# EAGLE design PocketStateMachine_r0_3 (EAGLE 7.7.0)
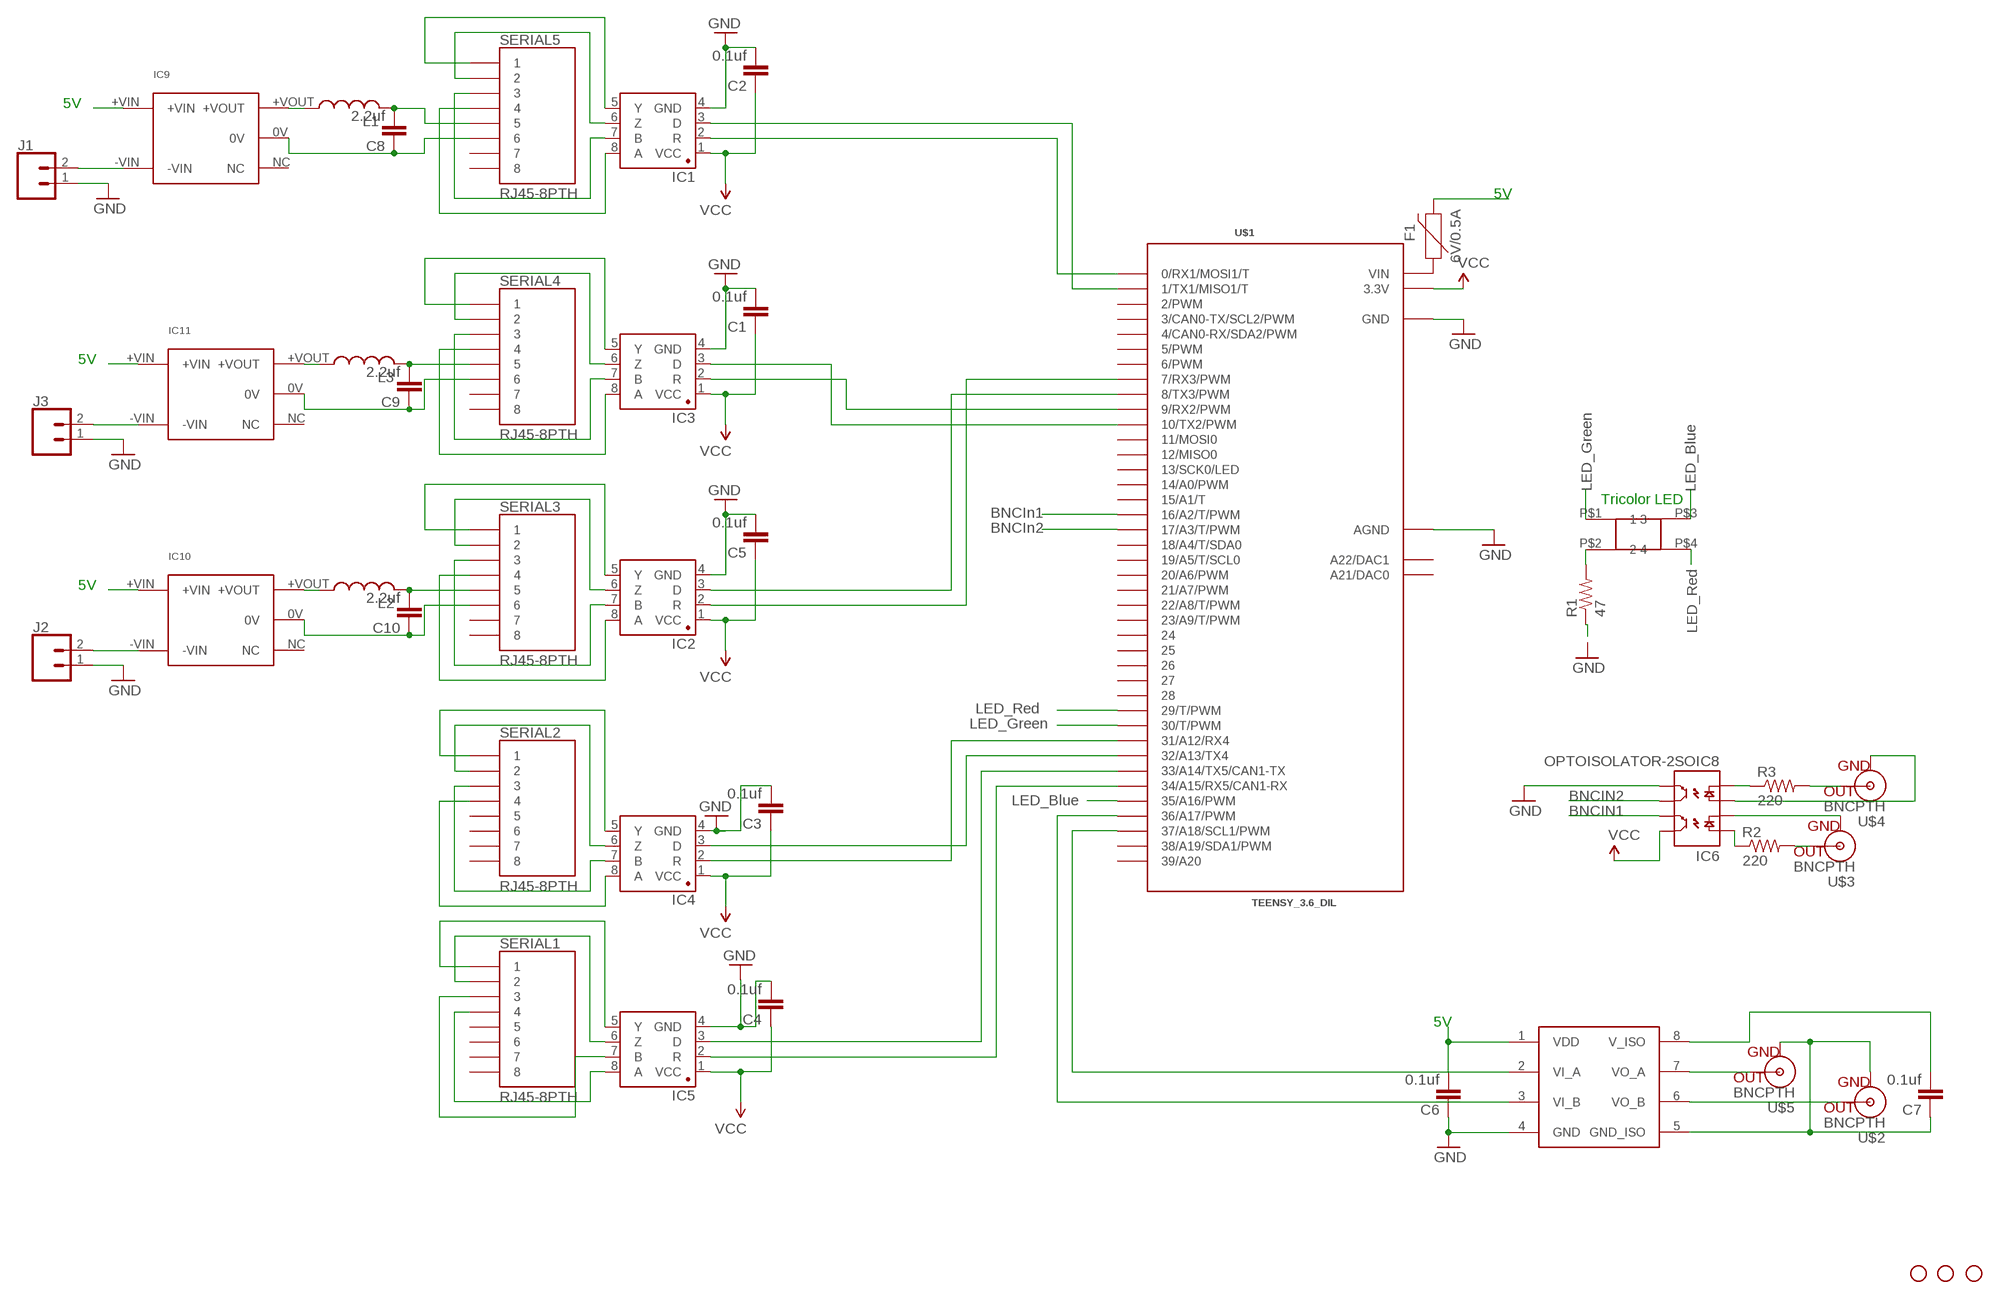
[diagram p0: schematic, sheet 1]

## Parts
C1  0.1uf  CAP1206  [1206]
C2  0.1uf  CAP1206  [1206]
C3  0.1uf  CAP1206  [1206]
C4  0.1uf  CAP1206  [1206]
C5  0.1uf  CAP1206  [1206]
C6  0.1uf  CAP1206  [1206]
C7  0.1uf  CAP1206  [1206]
C8  2.2uf  CAP1206  [1206]
C9  2.2uf  CAP1206  [1206]
C10  2.2uf  CAP1206  [1206]
F1  6V/0.5A  PPTC_HALF-AMP  [1206]
IC1  SN65HVD31DR  [SO08]
IC2  SN65HVD31DR  [SO08]
IC3  SN65HVD31DR  [SO08]
IC4  SN65HVD31DR  [SO08]
IC5  SN65HVD31DR  [SO08]
IC6  OPTOISOLATOR-2SOIC8  [SO08-2]
IC7  ADUM5240  [SO08]
IC9  MTU1D0505MC  [MTU1D0505MC]
IC10  MTU1D0505MC  [MTU1D0505MC]
IC11  MTU1D0505MC  [MTU1D0505MC]
J1  CONN_02  [1X02]
J2  CONN_02  [1X02]
J3  CONN_02  [1X02]
JP3  STAND-OFF  [STAND-OFF]
JP4  STAND-OFF  [STAND-OFF]
JP5  STAND-OFF  [STAND-OFF]
L1  L-USL3225M  [L3225M]
L2  L-USL3225M  [L3225M]
L3  L-USL3225M  [L3225M]
R1  47  RESISTOR1206  [1206]
R2  220  RESISTOR1206  [1206]
R3  220  RESISTOR1206  [1206]
SERIAL1  RJ45-8PTH  [RJ45-8]
SERIAL2  RJ45-8PTH  [RJ45-8]
SERIAL3  RJ45-8PTH  [RJ45-8]
SERIAL4  RJ45-8PTH  [RJ45-8]
SERIAL5  RJ45-8PTH  [RJ45-8]
U$1  TEENSY_3.6_DIL  [TEENSY_3.6_DIL]
U$2  BNCPTH  [BNC]
U$3  BNCPTH  [BNC]
U$4  BNCPTH  [BNC]
U$5  BNCPTH  [BNC]
U$8  SQUARE_TRICOLOR_LED  [SQUARE_TRICOLOR_LED]

## Nets
5V: C6.2 F1.2 IC7.1(VDD) IC9.+VIN IC10.+VIN IC11.+VIN
BNCIN1: IC6.7(EM1) U$1.16/A2(16/A2/T/PWM)
BNCIN2: IC6.6(CL2) U$1.17/A3(17/A3/T/PWM)
GND: C1.2 C2.2 C3.2 C4.2 C5.2 C6.1 IC1.4(GND) IC2.4(GND) IC3.4(GND) IC4.4(GND) IC5.4(GND) IC6.5(EM2) IC7.4(GND) J1.1 J2.1 J3.1 R1.1 U$1.AGND U$1.GND U$1.GND1(GND)
ISOGND: C7.1 IC7.5(GND_ISO) U$2.GND U$5.GND
LED_BLUE: U$1.35/A16(35/A16/PWM) U$8.P$3
LED_GREEN: U$1.30(30/T/PWM) U$8.P$1
LED_RED: U$1.29(29/T/PWM) U$8.P$4
N$1: IC3.8(A) SERIAL4.4
N$2: IC3.7(B) SERIAL4.3
N$3: IC3.6(Z) SERIAL4.2
N$4: IC3.5(Y) SERIAL4.1
N$5: IC3.2(R) U$1.9(9/RX2/PWM)
N$6: IC3.3(D) U$1.10(10/TX2/PWM)
N$7: IC1.8(A) SERIAL5.4
N$8: IC1.7(B) SERIAL5.3
N$9: IC1.6(Z) SERIAL5.2
N$10: IC1.5(Y) SERIAL5.1
N$11: IC1.2(R) U$1.0(0/RX1/MOSI1/T)
N$12: IC1.3(D) U$1.1(1/TX1/MISO1/T)
N$13: IC6.3(A2) U$4.GND
N$14: R3.2 U$4.S(OUT)
N$15: R2.2 U$3.S(OUT)
N$16: IC6.2(C1) U$3.GND
N$17: IC2.8(A) SERIAL3.4
N$18: IC2.7(B) SERIAL3.3
N$19: IC2.6(Z) SERIAL3.2
N$20: IC7.3(VI_B) U$1.36/A17(36/A17/PWM)
N$21: IC2.5(Y) SERIAL3.1
N$22: IC2.2(R) U$1.7(7/RX3/PWM)
N$23: C8.2 L1.2 SERIAL5.5
N$24: IC7.2(VI_A) U$1.37/A18(37/A18/SCL1/PWM)
N$25: R1.2 U$8.P$2
N$26: C8.1 IC9.0V SERIAL5.6
N$27: IC7.7(VO_A) U$5.S(OUT)
N$28: IC2.3(D) U$1.8(8/TX3/PWM)
N$29: F1.1 U$1.VIN
N$30: IC7.6(VO_B) U$2.S(OUT)
N$32: IC5.8(A) SERIAL1.4
N$33: IC5.7(B) SERIAL1.3
N$34: IC5.6(Z) SERIAL1.2
N$35: IC5.5(Y) SERIAL1.1
N$36: IC4.8(A) SERIAL2.4
N$37: IC4.7(B) SERIAL2.3
N$38: IC4.6(Z) SERIAL2.2
N$39: IC9.+VOUT L1.1
N$40: IC4.5(Y) SERIAL2.1
N$41: IC9.-VIN J1.2
N$42: IC5.2(R) U$1.34/A15(34/A15/RX5/CAN1-RX)
N$43: C10.1 IC10.0V SERIAL3.6
N$44: C10.2 L2.2 SERIAL3.5
N$45: IC10.+VOUT L2.1
N$46: IC10.-VIN J2.2
N$47: C9.1 IC11.0V SERIAL4.6
N$48: IC5.3(D) U$1.33/A14(33/A14/TX5/CAN1-TX)
N$49: C9.2 L3.2 SERIAL4.5
N$50: IC11.+VOUT L3.1
N$51: IC11.-VIN J3.2
N$52: IC4.2(R) U$1.31/A12(31/A12/RX4)
N$53: IC4.3(D) U$1.32/A13(32/A13/TX4)
N$54: IC6.1(A1) R2.1
N$55: IC6.4(C2) R3.1
N$64: C7.2 IC7.8(V_ISO)
VCC: C1.1 C2.1 C3.1 C4.1 C5.1 IC1.1(VCC) IC2.1(VCC) IC3.1(VCC) IC4.1(VCC) IC5.1(VCC) IC6.8(CL1) U$1.3.3V U$1.3.3V3(3.3V)
Unconnected: IC9.NC IC10.NC IC11.NC SERIAL1.5 SERIAL1.6 SERIAL1.7 SERIAL1.8 SERIAL2.5 SERIAL2.6 SERIAL2.7 SERIAL2.8 SERIAL3.7 SERIAL3.8 SERIAL4.7 SERIAL4.8 SERIAL5.7 SERIAL5.8 U$1.2(2/PWM) U$1.3(3/CAN0-TX/SCL2/PWM) U$1.4(4/CAN0-RX/SDA2/PWM) U$1.5(5/PWM) U$1.6(6/PWM) U$1.11(11/MOSI0) U$1.12(12/MISO0) U$1.13(13/SCK0/LED) U$1.14/A0(14/A0/PWM) U$1.15/A1(15/A1/T) U$1.18/A4(18/A4/T/SDA0) U$1.19/A5(19/A5/T/SCL0) U$1.20/A6(20/A6/PWM) U$1.21/A7(21/A7/PWM) U$1.22/A8(22/A8/T/PWM) U$1.23/A9(23/A9/T/PWM) U$1.24 U$1.25 U$1.26 U$1.27 U$1.28 U$1.38/A19(38/A19/SDA1/PWM) U$1.39/A20 U$1.A21(A21/DAC0) U$1.A22(A22/DAC1)

## Notes on the sheet
- 5V
- 5V
- 5V
- LED_Green
- LED_Blue
- Tricolor LED
- BNCIn1
- BNCIn2
- LED_Red
- 5V
- LED_Red
- LED_Green
- BNCIN2
- LED_Blue
- BNCIN1
- 5V

## Library data of the parts
C1-C10 = SparkFun-Capacitors:CAP: Capacitor Standard 0603 ceramic capacitor, and 0.1" leaded capacitor.
F1 = SparkFun-Fuses:PPTC: Resettable Fuse PPTC Resettable Fuse. Really a sort of resistor with a polymeric positive temperature coefficient whose resistance increases dramatically with an increase in temperature. When heated by the power passing through the resistance rises causing the current to be limited, protecting the circuit. This is achieved by the transition of the polymer from a crystalline to an amorphous state where the conductive carbon separates breaking the conductive pathways found in the cool crystalline structure. When a PPTC cools back down it resumes conducting letting the circuit turn back on. SparkFun Products: SparkFun RedBoard - Programmed with Arduino <https://www.sparkfun.com/products/12757> Pro Micro - 5V/16MHz <https://www.sparkfun.com/products/12640> Arduino Pro 328 - 5V/16MHz <https://www.sparkfun.com/products/10915> MP3 Trigger <https://www.sparkfun.com/products/13720>; PROD_ID: RES-08585
IC1-IC5 = Joshparts4:SN65HVD31DR: A placeholder for generic narrow & wide SOIC8 foorptints - used on the DIP adapter board.
IC6 = SparkFun-DiscreteSemi:OPTOISOLATOR-2: Description: Dual gate opto isolator. Vishay part : ILD213T; PROD_ID: IC-09076
IC7 = SparkFun-DigitalIC:ADUM5240
IC9-IC11 = JoshParts10:MTU1D0505MC
J1-J3 = SparkFun-Connectors:CONN_02: Multi connection point. Often used as Generic Header-pin footprint for 0.1 inch spaced/style header connections On any of the 0.1 inch spaced packages, you can populate with these: Break Away Headers - Straight <https://www.sparkfun.com/products/116> (PRT-00116) Break Away Male Headers - Right Angle <https://www.sparkfun.com/products/553> (PRT-00553) Female Headers <https://www.sparkfun.com/products/115> (PRT-00115) Break Away Headers - Machine Pin <https://www.sparkfun.com/products/117> (PRT-00117) Break Away Female Headers - Swiss Machine Pin <https://www.sparkfun.com/products/743> (PRT-00743) For SCREWTERMINALS and SPRING TERMINALS visit here: Screw Terimnals on SparkFun.com <https://www.sparkfun.com/search/results?term=Screw+Terminals> (5mm/3.5mm/2.54mm spacing) This device is also useful as a general connection point to wire up your design to another part of your project. Our various solder wires solder well into these plated through hole pads. Hook-Up Wire - Assortment (Stranded, 22 AWG) <https://www.sparkfun.com/products/11375> (PRT-11375) Hook-Up Wire - Assortment (Solid Core, 22 AWG) <https://www.sparkfun.com/products/11367> (PRT-11367) View the entire wire category on our website here <https://www.sparkfun.com/categories/141> Special notes: Molex polarized connector foot print use with: PRT-08233 with associated crimp pins and housings. 2.54_SCREWTERM for use with PRT-10571. 3.5mm Screw Terminal footprints for PRT-08084 5mm Screw Terminal footprints for use with PRT-08432
JP3-JP5 = SparkFun:STAND-OFF: Stand Off This is the mechanical footprint for a #4 phillips button head screw. Use the keepout ring to avoid running the screw head into surrounding components. SKU : PRT-00447
L1-L3 = rcl:L-US: INDUCTOR, American symbol
R1 = SparkFun-Passives:RESISTOR: Resistor Basic schematic elements and footprints for 0603, 1206, and PTH resistors.
R2 R3 = SparkFun-Resistors:RESISTOR: Resistor Basic schematic elements and footprints for 0603, 1206, and PTH resistors.
SERIAL1-SERIAL5 = SparkFun:RJ45-8: RJ45 Jack Simple RJ45, 8-pin connection - connector for common Cat5, Cat5e, and Cat6 Ethernet cables. Footprint not yet proven in production. Connector sku is PRT-00643; Breakout PCB sku is BOB-00716.
U$1 = Teensy_3_and_LC_Series_Boards_v1.4:TEENSY_3.6_DIL: Teensy 3.6 DIL Package
U$2-U$5 = SparkFun:BNC: BNC Connector, Mouser Part# 5227161
U$8 = JoshParts:SQUARE_TRICOLOR_LED

## Net classes
0 default: width 0.254 mm, clearance 0.254 mm

## Board
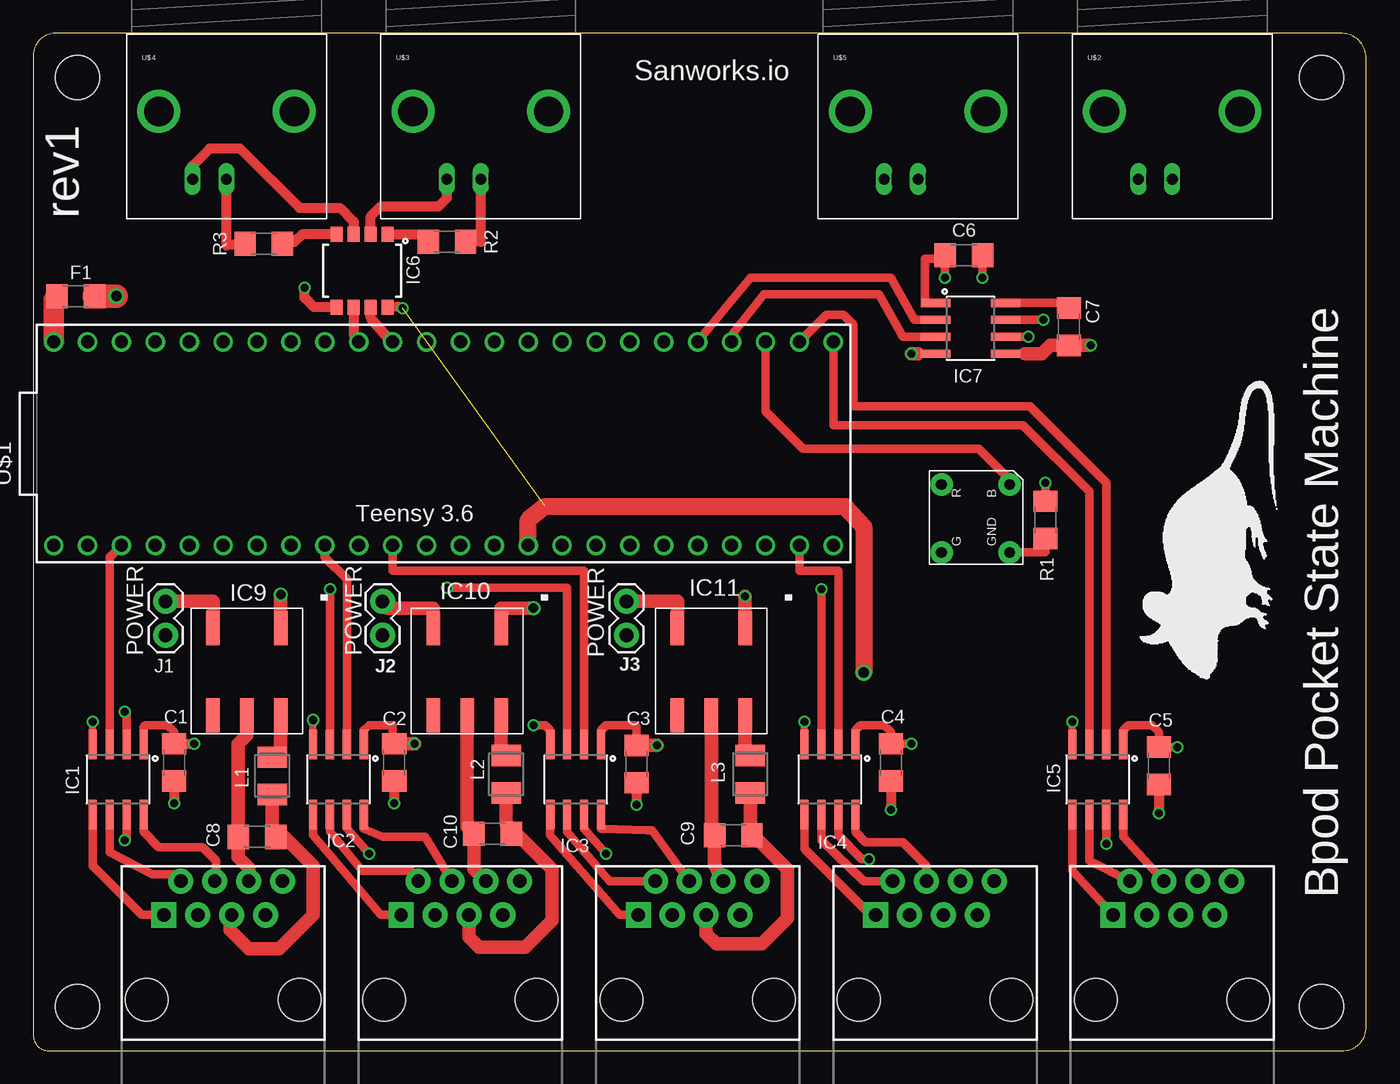
[diagram p1: board, top side]
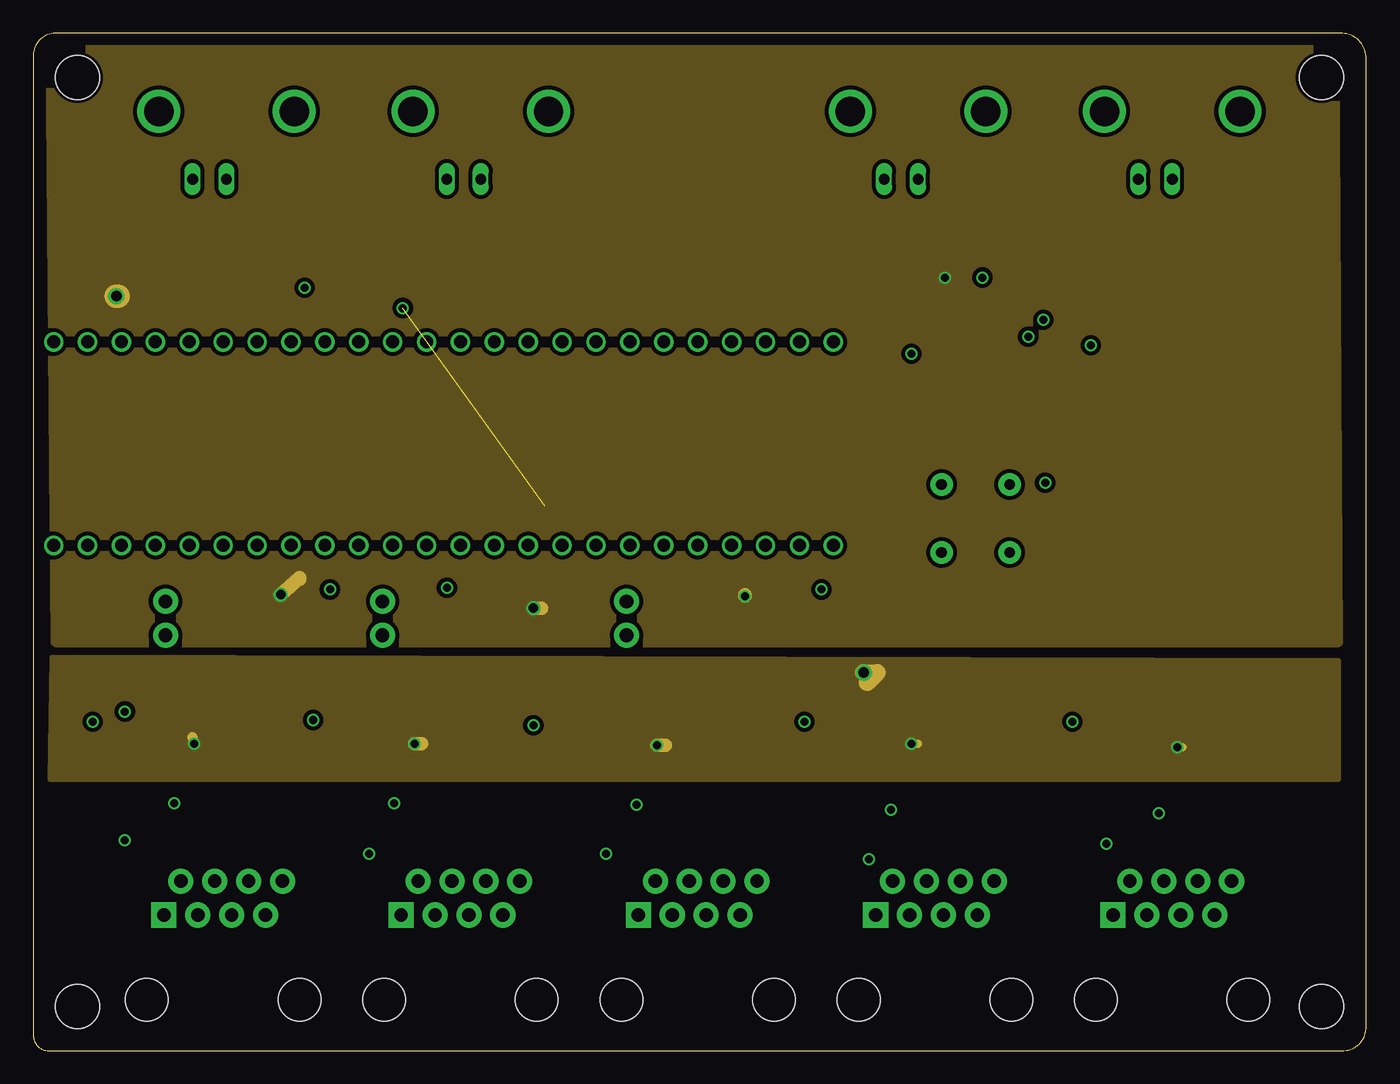
[diagram p2: board, inner layer Route2]
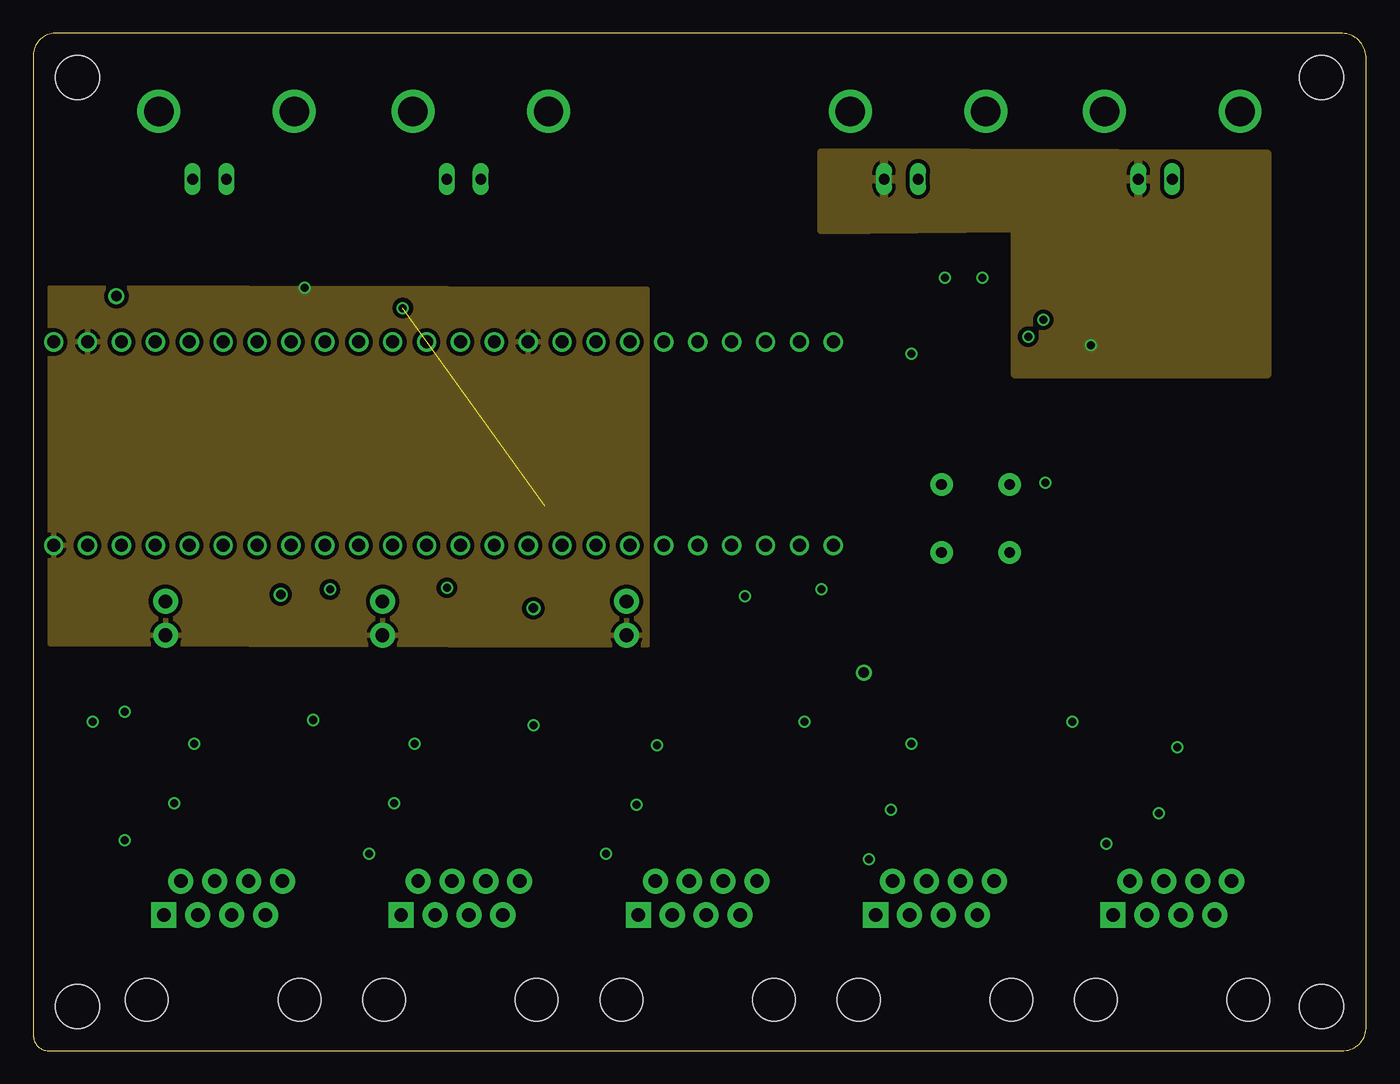
[diagram p3: board, inner layer Route15]
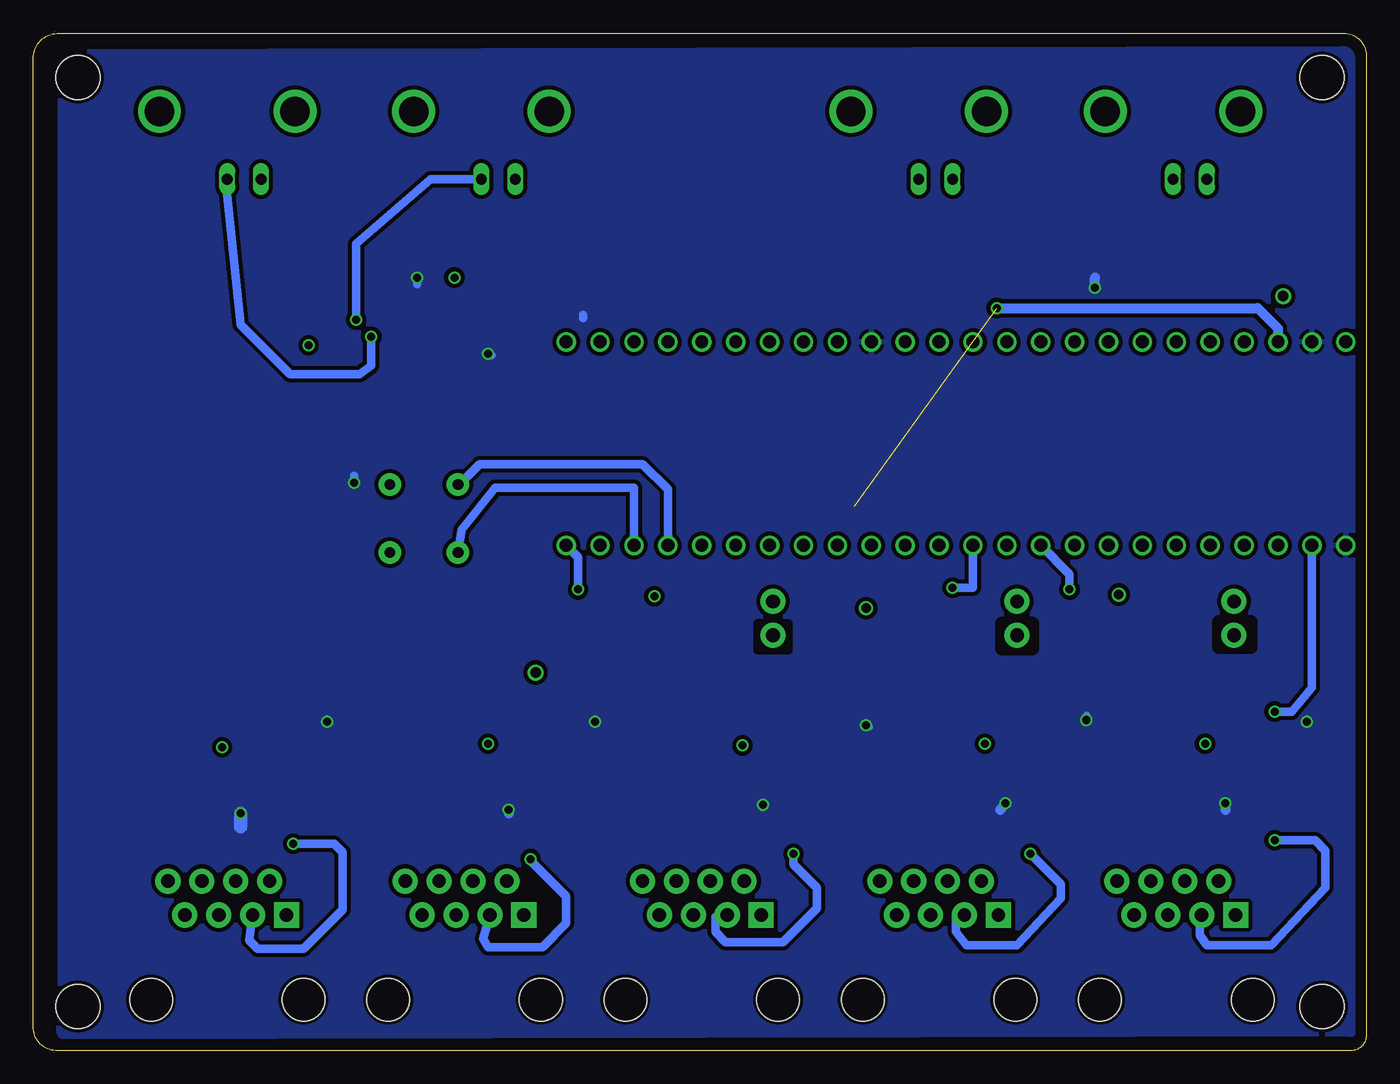
[diagram p4: board, bottom side, seen from below]

Size 99.87 x 76.2 mm. Coordinates in mm from the lower left corner, seen from the top.
Outline: 0,74.57 0,1.14 arc90 1.14,0 98.21,0 arc90 99.87,1.79 99.87,74.29 arc90 98.09,76.2 1.63,76.2 arc90 0,74.57
Copper layers (1*2*15*16): Top 0.035mm / dielectric 0.2mm / Route2 0.0175mm / dielectric 0.3mm / Route15 0.0175mm / dielectric 0.2mm / Bottom 0.035mm
Design rules "SeeedStudio_4layer_DRU_no_angle_20140221 *": minimum track width 8mil, minimum drill 12mil, track to track 12mil, track to pad 12mil, pad to pad 12mil, via to via 12mil, smd to smd 0mil, copper to edge 10mil, drill to drill 8mil, minimum pad ring 6mil, minimum via ring 4mil, stop-mask expansion 4mil, vias tented up to drill 25mil, thermal gap 10mil
bRestrict: area 8.6,30.2 to 11,32.1; area 25,30.1 to 27.3,32; area 43.3,30 to 45.6,32

### Footprints (pad centres in the part's own frame; a part is rotated, then mirrored left to right if it is on the bottom)
1206 = smd 1.6 x 1.8: 1 -1.4,0; 2 1.4,0
SO08 = smd 0.61 x 2.21: 1 -1.905,-2.616; 2 -0.635,-2.616; 3 0.635,-2.616; 4 1.905,-2.616; 5 1.905,2.616; 6 0.635,2.616; 7 -0.635,2.616; 8 -1.905,2.616
SO08-2 = smd 0.914 x 1.143: 1 -1.905,-2.731; 2 -0.635,-2.731; 3 0.635,-2.731; 4 1.905,-2.731; 5 1.905,2.731; 6 0.635,2.731; 7 -0.635,2.731; 8 -1.905,2.731
MTU1D0505MC = smd 2.54 x 1.016: 0V 6.502,0; +VIN 0,2.54; +VOUT 6.502,2.54; -VIN 0,-2.54; NC 6.502,-2.54
1X02 = drill 1.016 pad 1.88: 1 0,0; 2 2.54,0
STAND-OFF = hole 3.302: 0,0
L3225M = smd 1.6 x 2.2: 1 -1.4,0; 2 1.4,0
RJ45-8 = drill 1 pad 1.88 square: 1 -4.445,6.35 | drill 1 pad 1.88: 2 -3.175,8.89; 3 -1.905,6.35; 4 -0.635,8.89; 5 0.635,6.35; 6 1.905,8.89; 7 3.175,6.35; 8 4.445,8.89 | hole 3.2: -5.715,0; 5.715,0
TEENSY_3.6_DIL = drill 0.965: 0 -7.62,25.4; 1 -7.62,22.86; 2 -7.62,20.32; 3 -7.62,17.78; 3.3V 7.62,22.86; 3.3V3 -7.62,-7.62; 4 -7.62,15.24; 5 -7.62,12.7; 6 -7.62,10.16; 7 -7.62,7.62; 8 -7.62,5.08; 9 -7.62,2.54; 10 -7.62,0; 11 -7.62,-2.54; 12 -7.62,-5.08; 13 7.62,-5.08; 14/A0 7.62,-2.54; 15/A1 7.62,0; 16/A2 7.62,2.54; 17/A3 7.62,5.08; 18/A4 7.62,7.62; 19/A5 7.62,10.16; 20/A6 7.62,12.7; 21/A7 7.62,15.24; 22/A8 7.62,17.78; 23/A9 7.62,20.32; 24 -7.62,-10.16; 25 -7.62,-12.7; 26 -7.62,-15.24; 27 -7.62,-17.78; 28 -7.62,-20.32; 29 -7.62,-22.86; 30 -7.62,-25.4; 31/A12 -7.62,-27.94; 32/A13 -7.62,-30.48; 33/A14 7.62,-30.48; 34/A15 7.62,-27.94; 35/A16 7.62,-25.4; 36/A17 7.62,-22.86; 37/A18 7.62,-20.32; 38/A19 7.62,-17.78; 39/A20 7.62,-15.24; A21 7.62,-12.7; A22 7.62,-10.16; AGND 7.62,25.4; GND -7.62,27.94; GND1 7.62,-7.62; VIN 7.62,27.94
BNC = drill 2.2: 3 -5.08,5.08; 4 5.08,5.08 | drill 0.8 long: GND -2.54,0; S 0,0
SQUARE_TRICOLOR_LED = drill 0.8 pad 1.676: P$1 -5.1,5.1; P$2 -5.1,0; P$3 0,0; P$4 0,5.1

### Placement (x,y rotation side)
C1  10.54,21.59 270 top
C2  27.05,21.59 270 top
C3  45.21,21.46 270 top
C4  64.26,21.59 270 top
C5  84.33,21.34 270 top
C6  69.72,59.56 180 top
C7  77.6,54.23 90 top
C8  16.76,16 0 top
C9  52.45,16.13 0 top
C10  34.42,16.26 0 top
F1  3.17,56.52 0 top
IC1  6.35,20.32 180 top
IC2  22.86,20.32 180 top
IC3  40.64,20.32 180 top
IC4  59.69,20.32 180 top
IC5  79.76,20.32 180 top
IC6  24.64,58.42 180 top
IC7  70.23,54.1 270 top
IC9  16,31.62 270 top
IC10  32.51,31.62 270 top
IC11  50.8,31.62 270 top
J1  9.91,31.11 90 top
J2  26.16,31.11 90 top
J3  44.45,31.11 90 top
JP1  STAND-OFF  [STAND-OFF]  3.3,3.3 0 top
JP3  3.3,72.9 0 top
JP4  96.52,72.9 0 top
JP5  96.52,3.3 0 top
L1  17.91,20.57 270 top
L2  35.43,20.7 270 top
L3  53.72,20.7 270 top
R1  75.82,39.75 270 top
R2  30.99,60.58 0 top
R3  17.27,60.45 180 top
SERIAL1  85.34,3.81 0 top
SERIAL2  67.56,3.81 0 top
SERIAL3  32,3.81 0 top
SERIAL4  49.78,3.81 0 top
SERIAL5  14.22,3.81 0 top
U$1  29.46,45.47 90 top
U$2  85.34,65.28 0 top
U$3  33.53,65.28 0 top
U$4  14.48,65.28 0 top
U$5  66.29,65.28 0 top
U$8  73.15,42.42 90 top
U$9  [MOUSELOGO]  81.06,25.88 0 top

### Tracks (layer width: path | path; a pad name or v marks a point on that pad's centre or on a via)
5V  (via drill 0.6, 0.7, 0.8)
  Top 0.635: IC7.1 66.8,56.01 66.8,59.31 67.06,59.31 68.32,59.31 C6.2 v68.32,57.91 v68.33,57.91
  Top 1.016: IC9.+VIN v18.54,34.16 | IC10.+VIN 35.05,33.15 v37.47,33.15 | IC11.+VIN v53.34,34.04
  Top 1.778: F1.2 v6.22,56.52
  Route2 1.016: v18.54,34.16 19.94,35.43 19.94,35.31 | v37.47,33.15 38.1,33.15 | v53.34,34.04 53.34,34.16
  Route2 1.778: v6.22,56.52 6.35,56.52
  Route15 0.635: v68.33,57.91 68.33,57.78
  pour Route2: 1.27,74.93 1.65,30.61 97.79,30.61 97.54,74.93
BNCIN1
  Top 0.762: U$1.16/A2 26.8,53.09 25.27,54.86 IC6.7
BNCIN2
  Top 0.762: IC6.6 24,53.59 U$1.17/A3
GND  (via drill 0.6)
  Top 0.508: IC2.4 v20.95,24.77 | IC1.4 v4.45,24.64 | IC4.4 v57.78,24.64 | IC5.4 v77.85,24.64
  Top 0.635: IC3.4 38.73,24 38.35,24.38 v37.47,24.38 | R1.1 v75.82,42.55 | C6.1 71.12,57.79 v71.12,57.91 | 66.29,52.2 IC7.4
  Top 0.762: C5.2 v84.33,17.78 | C4.2 v64.26,18.03 | C3.2 v45.21,18.41 | C2.2 v27.05,18.54 | C1.2 v10.54,18.54 | IC6.5 21.02,55.69 20.32,56.39 v20.32,57.15
  Top 1.016: v65.79,52.2 66.29,52.2
  Bottom 0.508: v20.95,24.77 20.95,25.15 | v4.45,24.64 4.45,24.89 | v37.47,24.38 37.21,24.26 | v57.78,24.64 57.78,24.89 | v77.85,24.64 77.85,24.89
  Bottom 0.635: 58.67,55.12 58.67,54.86 | v75.82,42.55 75.82,43.05 | v71.12,57.91 71.12,57.4 | v65.79,52.2 65.66,52.2 65.53,52.07
  Bottom 0.762: v64.26,18.03 64.26,17.78 | v45.21,18.41 45.21,18.29 | v27.05,18.54 27.43,18.03 | v10.54,18.54 10.54,18.03 | v20.32,57.15 20.32,57.91
  Bottom 1.016: v84.33,17.78 84.33,16.76
  pour Bottom: 1.02,74.35 1.02,1.27 arc90 1.27,1.27 97.66,1.02 arc90 97.84,2.08 97.84,74.37 arc90 98.42,74.81 1.85,75.05 arc90
  pour Route15: 1.27,57.15 1.27,30.48 45.97,30.35 45.97,57.02
ISOGND  (via drill 0.6)
  Top 0.635: 79.12,52.83 v79.25,52.83 | C7.1 | 74.3,52.2 IC7.5
  Top 1.016: C7.1 79.12,52.83 | C7.1 76.2,52.83 75.56,52.2 74.3,52.2
  Route15 0.635: v79.25,52.83 79.38,52.83
  pour Route15: 59.05,67.31 59.05,61.47 73.53,61.59 73.53,50.67 92.46,50.67 92.46,67.18
LED_BLUE
  Top 0.635: U$8.P$3 73.15,42.8 70.87,45.09 57.66,45.09 54.86,47.88 U$1.35/A16
LED_GREEN
  Bottom 0.635: U$8.P$1 67.8,39.01 65.28,42.16 54.86,42.16 U$1.30
LED_RED
  Bottom 0.635: U$8.P$4 67.94,42.42 66.42,43.94 54.23,43.94 52.32,42.04 U$1.29
N$1
  Top 0.635: IC3.8 42.55,16.64 45.97,16.51 46.35,16.51 SERIAL4.4
N$2  (via drill 0.6)
  Top 0.635: IC3.7 41.27,16.64 v42.93,14.73
  Bottom 0.635: v42.93,14.73 42.93,13.97 41.15,12.19 41.15,10.67 43.69,8.13 48.01,8.13 48.77,8.89 48.77,10.03 SERIAL4.3
N$3
  Top 0.635: IC3.6 40.01,16.38 43.18,12.7 SERIAL4.2
N$4
  Top 0.635: IC3.5 38.73,16.13 43.94,10.16 SERIAL4.1
N$5
  Top 0.635: IC3.2 41.27,35.94 26.92,35.94 U$1.9
N$6  (via drill 0.6)
  Top 0.635: IC3.3 40.01,34.67 v30.99,34.67
  Bottom 0.635: U$1.10 29.46,34.67 v30.99,34.67
N$7
  Top 0.635: IC1.8 8.26,16.38 9.4,15.24 12.7,15.24 13.72,14.22 13.72,12.83 SERIAL5.4
N$8  (via drill 0.6)
  Top 0.635: IC1.7 6.99,15.88 v6.86,15.75
  Bottom 0.635: v6.86,15.75 3.81,15.75 3.05,14.99 3.05,12.19 7.11,7.87 11.94,7.87 12.45,8.64 12.45,10.03 SERIAL5.3
N$9
  Top 0.635: IC1.6 5.71,14.86 8.89,13.21 10.79,13.21 SERIAL5.2
N$10
  Top 0.635: IC1.5 4.45,13.84 8.13,10.16 SERIAL5.1
N$11  (via drill 0.6)
  Top 0.635: IC1.2 6.99,25.27 v6.86,25.4
  Bottom 0.635: v6.86,25.4 5.59,25.4 4.06,27.18 U$1.0
N$12
  Top 0.635: IC1.3 5.71,36.96 U$1.1
N$13
  Top 0.762: U$4.GND 11.94,66.29 13.21,67.56 15.49,67.56 19.94,63.12 22.99,63.12 24,62.1 IC6.3
N$14
  Top 0.762: R3.2 14.48,60.32 U$4.S
N$15
  Top 0.762: U$3.S 33.53,60.58 R2.2
N$16
  Top 0.762: IC6.2 25.27,62.48 26.04,63.25 30.35,63.25 30.99,63.88 U$3.GND
N$17
  Top 0.635: IC2.8 24.77,16.64 26.16,16 29.34,16 SERIAL3.4
N$18  (via drill 0.6)
  Top 0.635: IC2.7 23.5,16.64 v25.15,14.73
  Bottom 0.635: v25.15,14.73 22.86,12.45 22.86,11.43 26.16,7.87 29.97,7.87 30.73,8.89 30.73,10.03 SERIAL3.3
N$19
  Top 0.635: IC2.6 22.23,16.38 24.64,13.46 28.32,13.46 SERIAL3.2
N$20
  Top 0.635: U$1.36/A17 52.32,53.59 54.74,56.64 63.37,56.64 65.15,53.47 IC7.3
N$21
  Top 0.635: IC2.5 20.95,16.13 26.04,10.16 SERIAL3.1
N$22
  Top 0.635: IC2.2 23.5,35.31 21.84,36.96 U$1.7
N$23
  Top 1.016: SERIAL5.5 14.73,10.03 14.73,9.02 16.13,7.62 18.41,7.62 20.95,10.16 20.95,13.84 18.8,16 C8.2 17.91,16.26 L1.2 17.66,19.17
N$24
  Top 0.635: U$1.37/A18 53.72,57.91 64.26,57.91 66.04,54.74 IC7.2
N$25
  Top 0.635: U$8.P$2 75.8,37.32 75.82,37.34 R1.2
N$26
  Top 1.016: IC9.0V 16,23.62 15.36,22.98 C8.1 15.36,14.48 16.13,13.72 SERIAL5.6
N$27  (via drill 0.6)
  Top 0.635: IC7.7 v75.69,54.74
  Bottom 0.635: v75.69,54.74 75.69,60.45 70.1,65.28 U$5.S
N$28  (via drill 0.6)
  Top 0.635: IC2.3 v22.23,34.54
  Bottom 0.635: v22.23,34.54 22.23,35.69 U$1.8
N$29
  Top 1.524: U$1.VIN 1.52,56.26 F1.1
N$30  (via drill 0.6)
  Top 0.635: IC7.6 v74.55,53.47
  Bottom 0.635: v74.55,53.47 74.55,51.31 75.44,50.67 80.64,50.67 84.33,54.36 85.47,65.15 U$2.S
N$32
  Top 0.635: IC5.8 81.66,16 SERIAL1.4
N$33  (via drill 0.6)
  Top 0.635: IC5.7 v80.39,15.49
  Bottom 0.635: v80.39,15.49 77.34,15.49 76.71,14.86 76.71,10.54 79.63,7.62 83.06,7.62 83.69,8.26 SERIAL1.3
N$34
  Top 0.635: IC5.6 79.12,14.22 SERIAL1.2
N$35
  Top 0.635: IC5.5 77.85,13.46 SERIAL1.1
N$36
  Top 0.635: IC4.8 61.59,16.38 62.36,15.62 65.15,15.62 66.93,13.84 SERIAL2.4
N$37  (via drill 0.6)
  Top 0.635: IC4.7 60.33,16.13 62.1,14.35 v62.61,14.35
  Bottom 0.635: v62.61,14.35 62.61,14.22 59.94,11.56 59.94,9.53 61.72,7.75 65.79,7.75 66.17,8.38 SERIAL2.3
N$38
  Top 0.635: IC4.6 59.05,15.75 62.23,12.7 SERIAL2.2
N$39
  Top 1.016: IC9.+VOUT 18.54,22.61 L1.1
N$40
  Top 0.635: IC4.5 57.78,15.11 62.87,10.03 63.25,10.03 SERIAL2.1
N$41
  Top 1.016: IC9.-VIN 13.46,33.66 J1.2
N$42
  Top 0.635: IC5.2 80.39,42.55 74.68,48.26 61.47,48.26 61.47,54.36 60.71,55.12 59.44,55.12 U$1.34/A15
N$43
  Top 1.016: IC10.0V 32.51,16.76 C10.1 33.02,13.59 SERIAL3.6 33.64,12.96
N$44
  Top 0.635: C10.2 36.2,16.26 | 35.43,17.01 35.44,17.01 35.69,16.76
  Top 1.016: L2.2 35.43,17.01 | 35.69,16.76 36.2,16.26 38.86,13.59 38.86,9.78 36.83,7.75 33.4,7.75 32.64,8.51 SERIAL3.5
N$45
  Top 1.016: L2.1 35.05,22.1 IC10.+VOUT
N$46
  Top 1.016: IC10.-VIN 29.97,33.15 26.54,33.15 J2.2
N$47
  Top 1.016: IC11.0V 50.8,16.38 C9.1 51.05,13.97 SERIAL4.6 51.55,12.84
N$48
  Top 0.635: IC5.3 79.12,41.91 74.17,46.86 59.94,46.86 U$1.33/A14
N$49
  Top 1.016: 53.35,19.3 L3.2 53.72,16.26 C9.2 53.98,16.13 56.52,13.59 56.52,9.91 54.61,8 51.18,8 50.42,8.76 SERIAL4.5
N$50
  Top 1.016: IC11.+VOUT 53.34,22.1 L3.1
N$51
  Top 1.016: IC11.-VIN 48.26,33.66 J3.2
N$52
  Top 0.635: IC4.2 60.33,35.94 57.4,35.94 U$1.31/A12
N$53  (via drill 0.6)
  Top 0.635: IC4.3 v59.05,34.54
  Bottom 0.635: v59.05,34.54 59.05,36.96 U$1.32/A13
N$54
  Top 0.762: IC6.1 29.02,61.15 R2.1
N$55
  Top 0.762: IC6.4 20.13,61.15 19.56,60.58 18.8,60.58 R3.1
N$64
  Top 0.635: IC7.8 77.22,56.01 C7.2
VCC  (via drill 0.6, 0.8)  (1 unrouted)
  Top 0.635: IC1.1 8.26,24.26 8.38,24.38 10.03,24.38 10.54,23.88 C1.1 | IC2.1 24.77,24 25.15,24.38 26.92,24.38 26.92,23.88 C2.1 | IC3.1 42.55,24 42.93,24.38 45.09,24.38 45.21,24.26 C3.1 | IC4.1 61.59,24 61.98,24.38 63.75,24.38 64.26,23.88 C4.1 v65.78,22.99 v65.79,22.99 | IC5.1 81.66,24 82.04,24.38 83.82,24.38 84.33,23.88 C5.1 v85.72,22.74 v85.72,22.73
  Top 0.762: IC6.8 27.3,55.75 v27.69,55.63 | C1.1 11.94,22.99 v12.06,22.99
  Top 1.016: C2.1 v28.57,22.99 | C3.1 v46.73,22.86 v46.74,22.86
  Top 1.27: U$1.3.3V3 37.08,39.75 38.35,40.77 60.83,40.77 62.23,39.24 v62.23,28.32
  Route2 0.635: v65.79,22.99 66.29,22.99 | v85.72,22.73 86.11,22.73
  Route2 0.762: v12.06,22.99 11.94,23.5
  Route2 1.016: v28.57,22.99 29.08,22.99 | v46.74,22.86 47.37,22.86
  Route2 1.27: v62.23,28.32 63.25,28.32 62.48,27.56
  Bottom 0.762: v27.69,55.63 8.13,55.63 6.6,54.1 U$1.3.3V
  pour Route2: 1.4,29.46 1.27,20.32 97.79,20.32 97.79,29.21

### Text on the board
tPlace: Sanworks.io | rev1 | Teensy 3.6 | POWER | POWER | POWER | Bpod Pocket State Machine